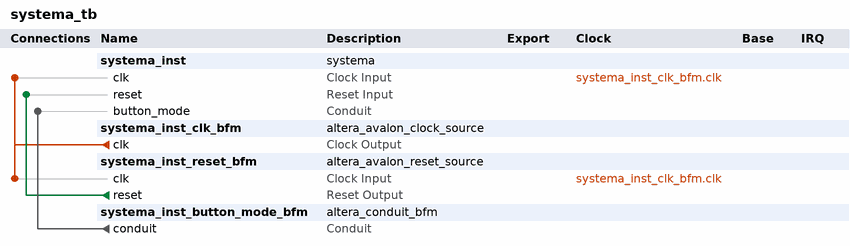
[diagram p0: system contents]
# Platform Designer (Qsys) system systema_tb, Cyclone V 5CEBA2F17A7
# Parameters at their usual value, and those the tool derives, are not listed.
package require -exact qsys 18.1
create_system systema_tb
set_project_property DEVICE_FAMILY {Cyclone V}
set_project_property DEVICE 5CEBA2F17A7

add_instance systema_inst systema 1.0

add_instance systema_inst_clk_bfm altera_avalon_clock_source 18.1

add_instance systema_inst_reset_bfm altera_avalon_reset_source 18.1
set_instance_parameter_value systema_inst_reset_bfm ASSERT_HIGH_RESET 0
set_instance_parameter_value systema_inst_reset_bfm INITIAL_RESET_CYCLES 50

add_instance systema_inst_button_mode_bfm altera_conduit_bfm 18.1
set_instance_parameter_value systema_inst_button_mode_bfm CLOCKED_SIGNAL false
set_instance_parameter_value systema_inst_button_mode_bfm ENABLE_RESET false
set_instance_parameter_value systema_inst_button_mode_bfm SIGNAL_DIRECTIONS output
set_instance_parameter_value systema_inst_button_mode_bfm SIGNAL_WIDTHS 4

# connections
add_connection systema_inst_clk_bfm.clk systema_inst.clk clock
add_connection systema_inst_clk_bfm.clk systema_inst_reset_bfm.clk clock
add_connection systema_inst_reset_bfm.reset systema_inst.reset reset
add_connection systema_inst_button_mode_bfm.conduit systema_inst.button_mode conduit

set_interconnect_requirement {$system} qsys_mm.clockCrossingAdapter HANDSHAKE
set_interconnect_requirement {$system} qsys_mm.enableEccProtection FALSE
set_interconnect_requirement {$system} qsys_mm.insertDefaultSlave FALSE
set_interconnect_requirement {$system} qsys_mm.maxAdditionalLatency 1

save_system systema_tb.qsys
